# Altium schematic sheet ADC Module.SchDoc
size A4; Organization: TESLA Motors, INC; Address1: 3500 Deer Creek Road; Address2: Palo Alto, CA; Address4: U.S.A.; SheetNumber: 1; SheetTotal: 2
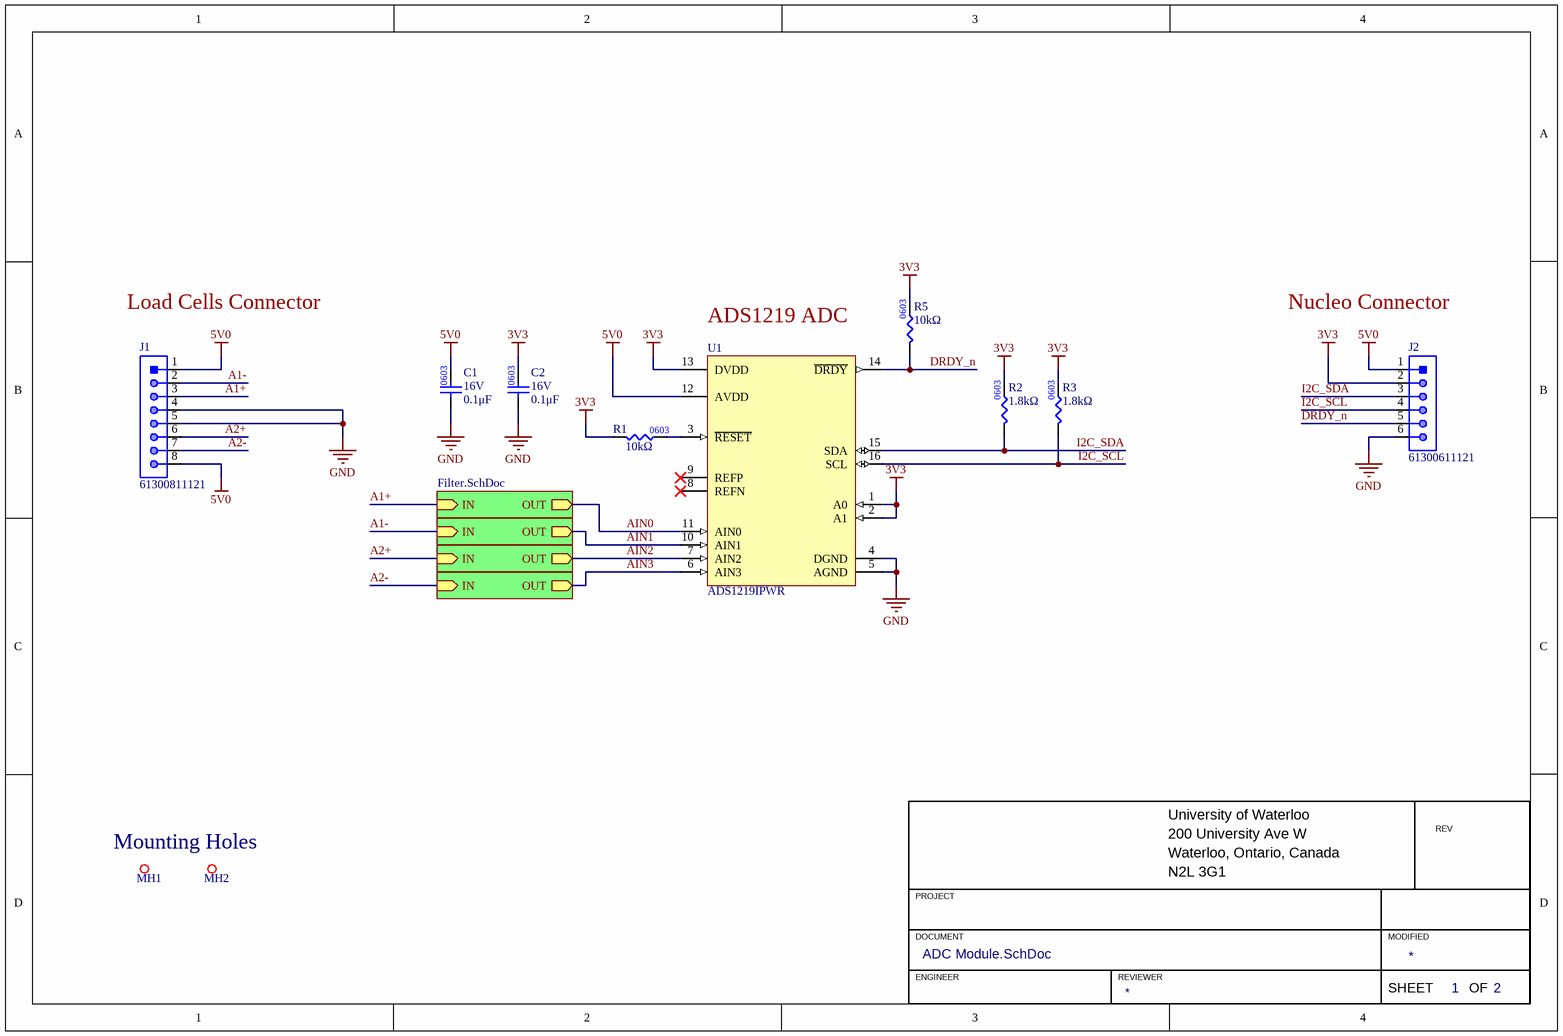
[diagram p0: ADC Module.SchDoc]

## Parts
C1  value 0.1μF  Voltage Rating: 16V  [CAP0603]  (hidden comment: CAP_0.1uF_16V_0603)
C2  value 0.1μF  Voltage Rating: 16V  [CAP0603]  (hidden comment: CAP_0.1uF_16V_0603)
J1  Manufacturer Part Number 1: 61300811121  [HDR1X8]  (hidden comment: HEADER 8x1)
J2  Manufacturer Part Number 1: 61300611121  [HDR1X6]  (hidden comment: HEADER 6x1)
MH1  MOUNTING_HOLE_M3  [MOUNTING_HOLE_3mm]  (value not drawn)  (no BOM)
MH2  MOUNTING_HOLE_M3  [MOUNTING_HOLE_3mm]  (value not drawn)  (no BOM)
R1  value 10kΩ  [RES0603]  (hidden comment: RES_10kΩ_0603_1%)
R2  value 1.8kΩ  [RES0603]  (hidden comment: RES_1.8kΩ_0603_1%)
R3  value 1.8kΩ  [RES0603]  (hidden comment: RES_1.8kΩ_0603_1%)
R5  value 10kΩ  [RES0603]  (hidden comment: RES_10kΩ_0603_1%)
U1  ADS1219IPWR  [TI_16-TSSOP]

## Sub-sheets
AIN0 = Filter.SchDoc: IN (in), OUT (out)
AIN1 = Filter.SchDoc: IN (in), OUT (out)
AIN2 = Filter.SchDoc: IN (in), OUT (out)
AIN3 = Filter.SchDoc: IN (in), OUT (out)

## Nets
3V3: C2.2 J2.2 R1.1 R2.2 R3.2 R5.2 U1.1(A0) U1.2(A1) U1.13(DVDD)
5V0: C1.2 J1.1 J1.8 J2.1 U1.12(AVDD)
GND: C1.1 C2.1 J1.4 J1.5 J2.6 U1.4(DGND) U1.5(AGND)
A1+: J1.3 ; sheet AIN0/IN
A1-: J1.2 ; sheet AIN1/IN
A2+: J1.6 ; sheet AIN2/IN
A2-: J1.7 ; sheet AIN3/IN
AIN0: U1.11(AIN0) ; sheet AIN0/OUT
AIN1: U1.10(AIN1) ; sheet AIN1/OUT
AIN2: U1.7(AIN2) ; sheet AIN2/OUT
AIN3: U1.6(AIN3) ; sheet AIN3/OUT
DRDY_n: J2.5 R5.1 U1.14(~{DRDY})
I2C_SCL: J2.4 R3.1 U1.16(SCL)
I2C_SDA: J2.3 R2.1 U1.15(SDA)
NetR1_2: R1.2 U1.3(~{RESET})

Not connected (* = marked no-connect by the designer): U1 8(REFN)* 9(REFP)*

## Notes on the sheet
- Load Cells Connector
- Nucleo Connector
- (near U1) ADS1219 ADC
- Mounting Holes
- University of Waterloo
- 200 University Ave W
- REV
- PROJECT
- Waterloo, Ontario, Canada
- N2L 3G1
- DOCUMENT
- ENGINEER
- REVIEWER
- MODIFIED
- SHEET
- OF

## Library data of the parts
C1 C2 = CAP_0.1uF_16V_0603: CAP CER 0.1UF 16V X7R 0603; Manufacturer Part Number 1: CC0603KRX7R7BB104; Manufacturer 1: Yageo; Package: 0603; Supplier Part Number 1: 311-1088-1-ND; Supplier 1: Digi-Key; Dielectric: X7R
J1 = HEADER 8x1: CONN HEADER VERT 8POS 2.54MM; Manufacturer 1: Würth Elektronik; Mounting Type: TH; Pitch: 2.54mm; Supplier 1: Digikey; Supplier Part Number 1: 732-5321-ND
J2 = HEADER 6x1: CONN HEADER VERT 6POS 2.54MM; Manufacturer 1: Würth Elektronik; Supplier 1: Digi-Key; Mounting Type: TH; Pitch: 2.54mm; Supplier Part Number 1: 732-5319-ND
R1 R5 = RES_10kΩ_0603_1%: RES 10K OHM 1% 1/8W 0603; Manufacturer 1: Stackpole Electronics Inc; Manufacturer Part Number 1: RNCP0603FTD10K0; Supplier Part Number 1: RNCP0603FTD10K0CT-ND; Supplier 1: Digi-Key; Mounting Type: SMD; Package: 0603
R2 R3 = RES_1.8kΩ_0603_1%: RES 1.8K OHM 1% 1/10W 0603; Manufacturer 1: Yageo; Manufacturer Part Number 1: RC0603FR-071K8L; Package: 0603; Supplier 1: Digikey; Supplier Part Number 1: 311-1.80KHRCT-ND
U1 = ADS1219IPWR: IC ADC 24BIT SIGMA-DELTA 16TSSOP; Manufacturer 1: Texas Instruments; Manufacturer Part Number 1: ADS1219IPWR; Footprint: 16-TSSOP; Supplier 1: Digikey; Supplier Part Number 1: 296-50884-1-ND